# Altium schematic sheet MainBoard_MCU_Power.SchDoc
size B
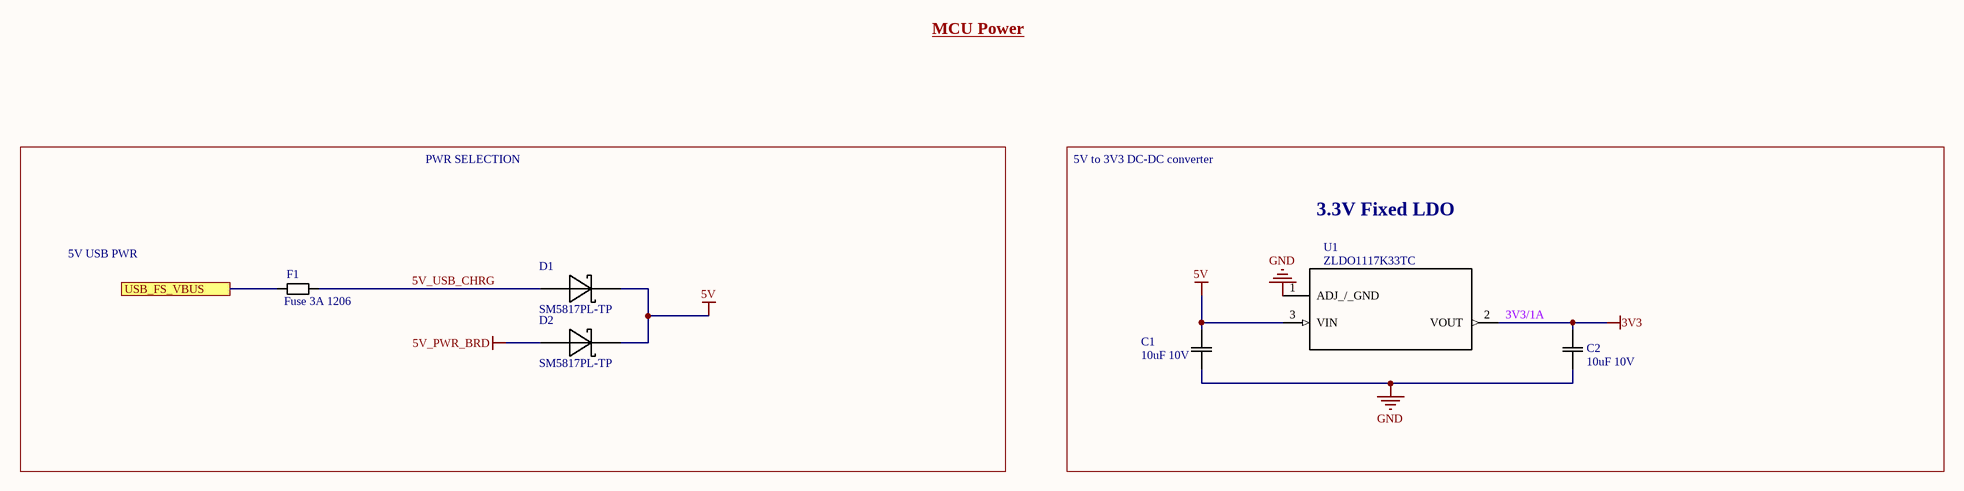
[diagram p0: MainBoard_MCU_Power.SchDoc]

## Parts
C1  10uF 10V  [0603]
C2  10uF 10V  [0603]
D1  SM5817PL-TP  [SOD-123]
D2  SM5817PL-TP  [SOD-123]
F1  Fuse 3A 1206  [1206]
U1  ZLDO1117K33TC  [DPAK (TO-252)]

## Blocks framed on the sheet
3.3V Fixed LDO: C1 C2 U1

## Ports
USB_FS_VBUS

## Nets
3V3: C2.1(C1) U1.2(VOUT)
5V: C1.1(C1) D1.C(K) D2.C(K) U1.3(VIN)
5V_PWR_BRD: D2.A
GND: C1.2(C2) C2.2(C2) U1.1(ADJ_/_GND)
5V_USB_CHRG: D1.A F1.2
USB_FS_VBUS: F1.1 ; port USB_FS_VBUS

## Notes on the sheet
- MCU Power
- PWR SELECTION
- 5V to 3V3 DC-DC converter
- 5V USB PWR
- 3V3/1A

## Library data of the parts
C1 C2 = CAP 10uF 10V: CAP CER 10UF 10V X5R 0805; Tolerance: 10%; Package: 0805; Value: 10uF; Rating: 10V
D1 D2 = DIODE SCHOTTKY 20V 1A: Diode Schottky 20V 1A Surface Mount SOD-123FL; MF: Micro Commercial Co; ComponentLink1Description: digikey; ComponentLink1URL: https://www.digikey.ca/product-detail/en/on-semiconductor/MBR0540T1G/MBR0540T1GOSCT-ND/917967; Digikey: SM5817PL-TPMSCT-ND; Digikey Link: https://www.digikey.ca/product-detail/en/micro-commercial-co/SM5817PL-TP/SM5817PL-TPMSCT-ND/1793410; MP: SM5817PL-TP; Voltage Rating: 20V; Package: SOD-123; Current Rating: 1A
F1 = FUSE 3A 63V SLOW: FUSE 3A 63V AC/DC SLOW 1206; Response Time: Slow Blow; Current Rating (Amps): 3A; Operating Temperature: -55°C ~ 90°C; Voltage Rating - AC: 63V; Voltage Rating - DC: 63V
U1 = ZLDO1117K33TC: Linear Voltage Regulator IC Positive Fixed 1 Output  1A TO-252-3; MF: Diodes Incorporated; Package: TO-252-3; MP: ZLDO1117K33TC; Digikey: ZLDO1117K33DIDKR-ND; Digikey Link: https://www.digikey.ca/product-detail/en/diodes-incorporated/ZLDO1117K33TC/ZLDO1117K33DIDKR-ND/2095639; Supplier 1: Digi-Key; Supplier Part Number 1: ZLDO1117K33DICT-ND